# Altium schematic sheet Brakelight.SchDoc
size A; SheetNumber: 1; SheetTotal: 5
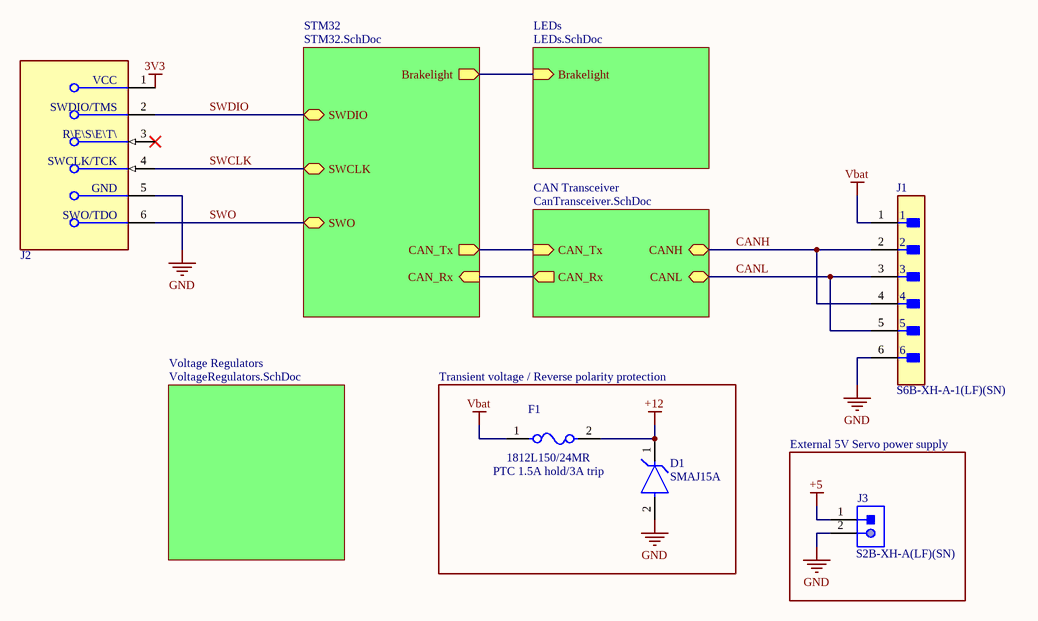
[diagram p0: Brakelight.SchDoc]

## Parts
D1  SMAJ15A  [FP-SMA-MFG]
F1  1812L150/24MR  [FP-1812L-MFG]
J1  S6B-XH-A-1(LF)(SN)  [FP-S6B-XH-A-1_LF_SN-MFG]
J2  TC2030-CTX-NL  [Tag_Connect_0_MFG]  (value not drawn)
J3  S2B-XH-A(LF)(SN)  [JST-S2B-XH-A(LF)(SN)_V]

## Blocks framed on the sheet
External 5V Servo power supply: J3

## Sub-sheets
CAN Transceiver = CanTransceiver.SchDoc: CANL (bidir), CAN_Tx (in), CANH (bidir), CAN_Rx (out)
LEDs = LEDs.SchDoc: Brakelight (in)
STM32 = STM32.SchDoc: CAN_Tx (out), CAN_Rx (in), Brakelight (out), SWDIO (bidir), SWO (bidir), SWCLK (bidir)
Voltage Regulators = VoltageRegulators.SchDoc: no entries

## Nets
3V3: J2.1(VCC)
+5: J3.1
+12: D1.1(C) F1.2
GND: D1.2(A) J1.6 J2.5(GND) J3.2
Vbat: F1.1 J1.1
CANH: J1.2 J1.4 ; sheet CAN Transceiver/CANH
CANL: J1.3 J1.5 ; sheet CAN Transceiver/CANL
SWCLK: J2.4(SWCLK/TCK) ; sheet STM32/SWCLK
SWDIO: J2.2(SWDIO/TMS) ; sheet STM32/SWDIO
SWO: J2.6(SWO/TDO) ; sheet STM32/SWO
(unnamed): sheet LEDs/Brakelight, sheet STM32/Brakelight
(unnamed): sheet STM32/CAN_Tx, sheet CAN Transceiver/CAN_Tx
(unnamed): sheet STM32/CAN_Rx, sheet CAN Transceiver/CAN_Rx

Not connected (* = marked no-connect by the designer): J2 3(~{RESET})*

## Notes on the sheet
- Transient voltage / Reverse polarity protection
- PTC 1.5A hold/3A trip

## Library data of the parts
D1 = CMP-07401-000026-1: TVS DIODE 15V 24.4V SMA; Manufacturer: Bourns Inc.; Max Junction Temp: +150°C; Peak Pulse Current: 16.4A; Direction: Unidirectional; Breakdown Voltage: 16.7V; Number Of Channels: 1; Peak Pulse Power: 400W; Mouser Description: Bourns Smaj15a / Diode Tvs 15v 400w Uni 5% Smd Bourns; Temperature Range Low: -55°C; ComponentLink2Description: Datasheet; Package: SMA; Reverse Standoff Voltage: 15V; Category: Diode; Device Class L2: TVS Diodes; Lead Free: Yes; RoHS: TRUE; Clamping Voltage: 24.4V; ComponentLink2URL: https://www.bourns.com/docs/Product-Datasheets/SMAJ.pdf; Digikey Description: TVS DIODE 15V 24.4V SMA; Temperature Range High: +150°C; Height: 2.29mm; Device Class L1: Circuit Protection; Device Class L3: unset; Temperature: -55°C to +150°C; Octopart: https://octopart.com/smaj15a-bourns-12809353; Manufacturer Part Number: SMAJ15A; Automotive: No
F1 = CMP-08606-000018-1: PTC RESET FUSE 24V 1.5A 1812; Manufacturer: Littelfuse Inc; Trip Current: 3A; Resistance: 0.04-0.12Ω; Current Rating: 20A; Trip Time: 1.5s; Value: 0.04-0.12Ω; Mouser Description: Resettable Fuses - PPTC 24V 1.5A-HD 40A MAX; Ipc Land Pattern Name: CAPC455324X130; Lead Free: Yes; Height: 1.8mm; RoHS: TRUE; Octopart: https://octopart.com/1812l150%2F24mr-littelfuse-7130198; Ambient Temperature Range Low: -40°C; Temperature Range High: +85°C; Automotive: No; Hold Current: 1.5A; Package: 1812L; ComponentLink2Description: Datasheet; Temperature: -40°C to +85°C; Digikey Description: PTC RESET FUSE 24V 1.5A 1812; Device Class L3: unset; ComponentLink2URL: https://www.littelfuse.com/~/media/electronics/datasheets/resettable_ptcs/littelfuse_ptc_1812l_datasheet.pdf.pdf; Voltage Rating: 24V; Device Class L2: PTC Resettable Fuses; Device Class L1: Circuit Protection; Temperature Range Low: -40°C; Manufacturer Part Number: 1812L150/24MR; Category: Fuse; Ambient Temperature Range High: +85°C
J1 = CMP-17439-000023-1: CONN HEADER R/A P6OS 2.5MM; Voltage Rating: 250V; Insulation Resistance: 1GR; Current Rating: 3A; Number of Positions: 6; Gender: Male; Mount: Through Hole; Material: Polyamide; Max Operating Temperature: 85°C; Contact Plating: Tin; Number of Rows: 1; Color: Natural; Termination: Crimp; Min Operating Temperature: -25°C; Pitch: 2.5mm; Lead Free: Lead Free; Contact Material: Brass
J3 = CMP-1755-00005-1: Male Header, Pitch 2.5 mm, 1 x 2 Position, Height 6.1 mm, Tail Length 3.4 mm, -25 to 85 degC, RoHS, Bulk; Type (Capacitors): X7R; Voltage Rating (DC): 100 V; Tolerance: 10%; Capacitance: 1 nF; Case\Package: Radial; Min Operating Temperature: -55 degC; Mount: Through Hole; Package Quantity: 500; PackageReference: S2B-XH-A(LF)(SN); ComponentLink1Description: Manufacturer URL; Max Operating Temperature: 125 degC; ComponentLink2Description: Datasheet; RoHSCompliant: true; PackageDescription: Male Header, Pitch 2.5 mm, 1 x 2 Position, Height 6.1 mm, Tail Length 3.4 mm; REACH SVHC: No SVHC; Packaging: Bulk; Width: 3.81 mm; Length: 5.33 mm; Height: 2.54 mm; Pins: 2; Radiation Hardening: No; ComponentLink1URL: http://www.jst.com/home2.html; Lead Pitch: 2.54 mm; DatasheetVersion: May-16; Voltage Rating: 100 V; ComponentLink2URL: http://www.jst-mfg.com/product/pdf/eng/eXH.pdf